# Altium schematic sheet A3_2.SchDoc: [Название]
size 420 x 297 mm; ApprovedBy: [Утвердил]; CheckedBy: [Пров.]; Author: [Разраб.]; CompanyName: [Компания]; DocumentNumber: [АБВГ.000000.000]; SheetNumber: [Лист]; SheetTotal: [Листов]; ProcessInspection: [Т. контр.]; NormInspection: [Н. контр.]; firstReference: [Перв. применение]; CopiedBy: [Копировал]
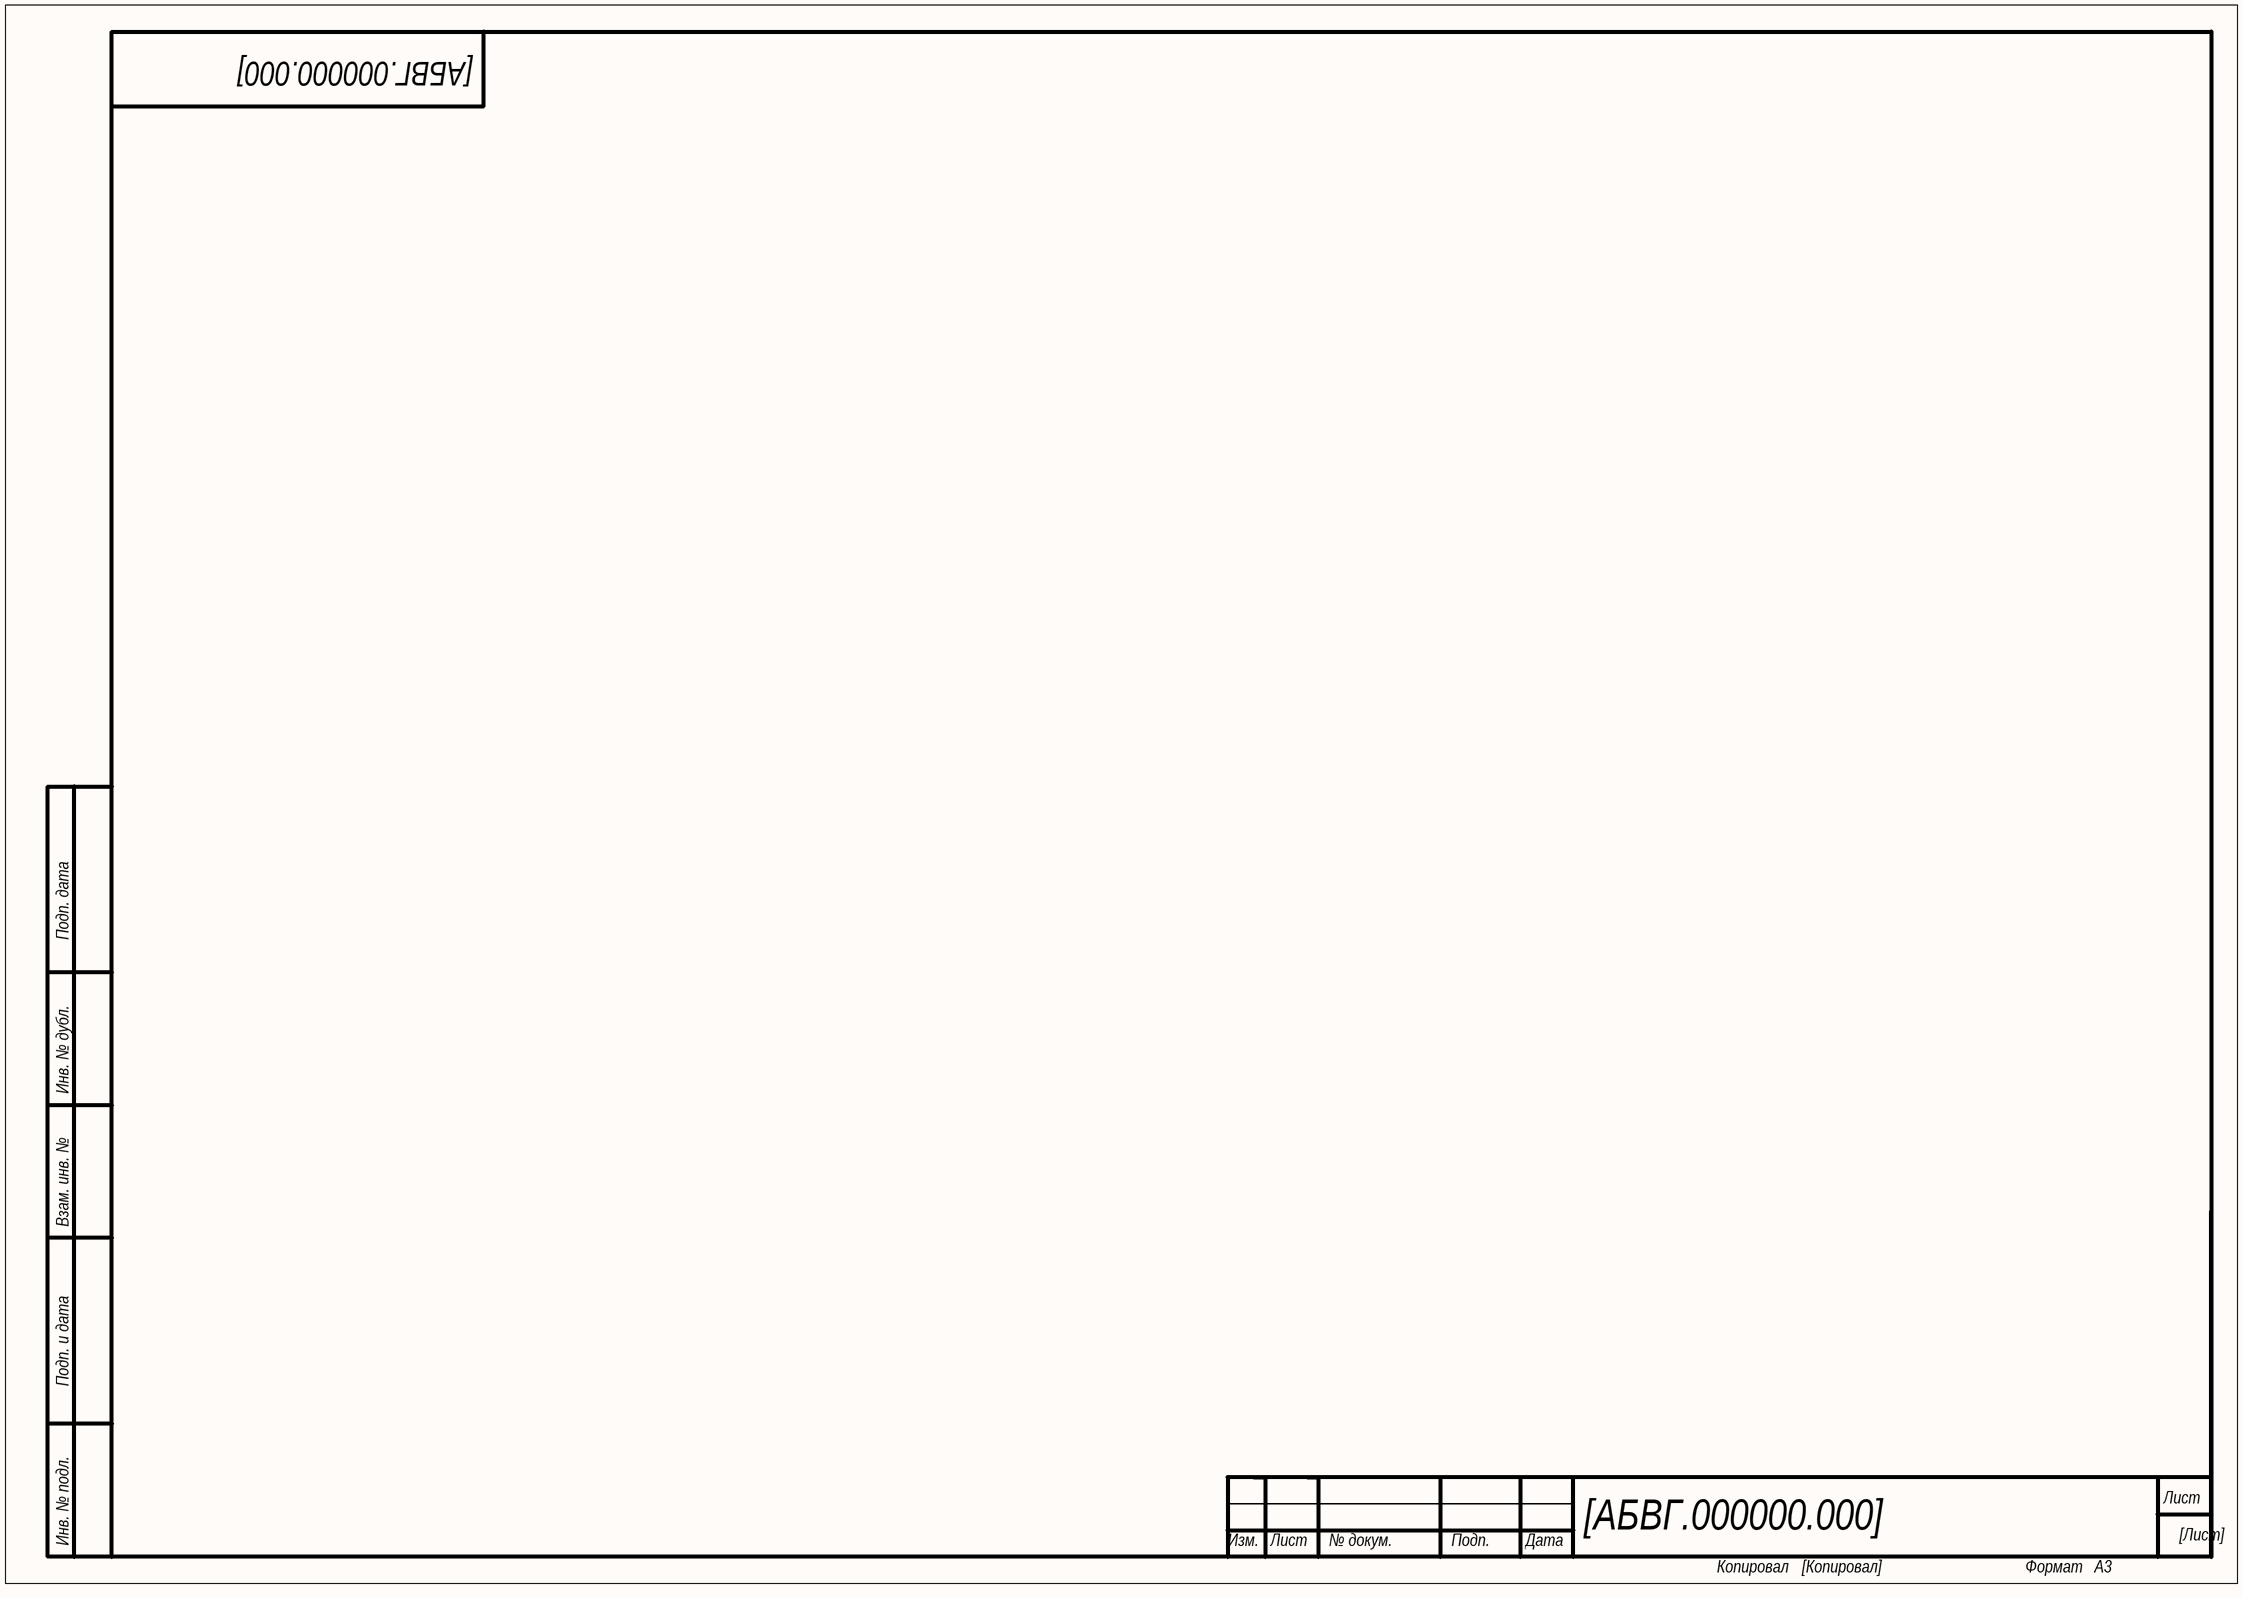
[diagram p0: A3_2.SchDoc]

## Notes on the sheet
- Подп. дата
- Инв. № дубл.
- Взам. инв. №
- Подп. и дата
- Инв. № подл.
- Лист
- Изм.
- № докум.
- Подп.
- Дата
- Копировал
- Формат
- А3